# EAGLE schematic pc_healthypi_5.3 (EAGLE 9.6.2)

## Sheet 1 of 3
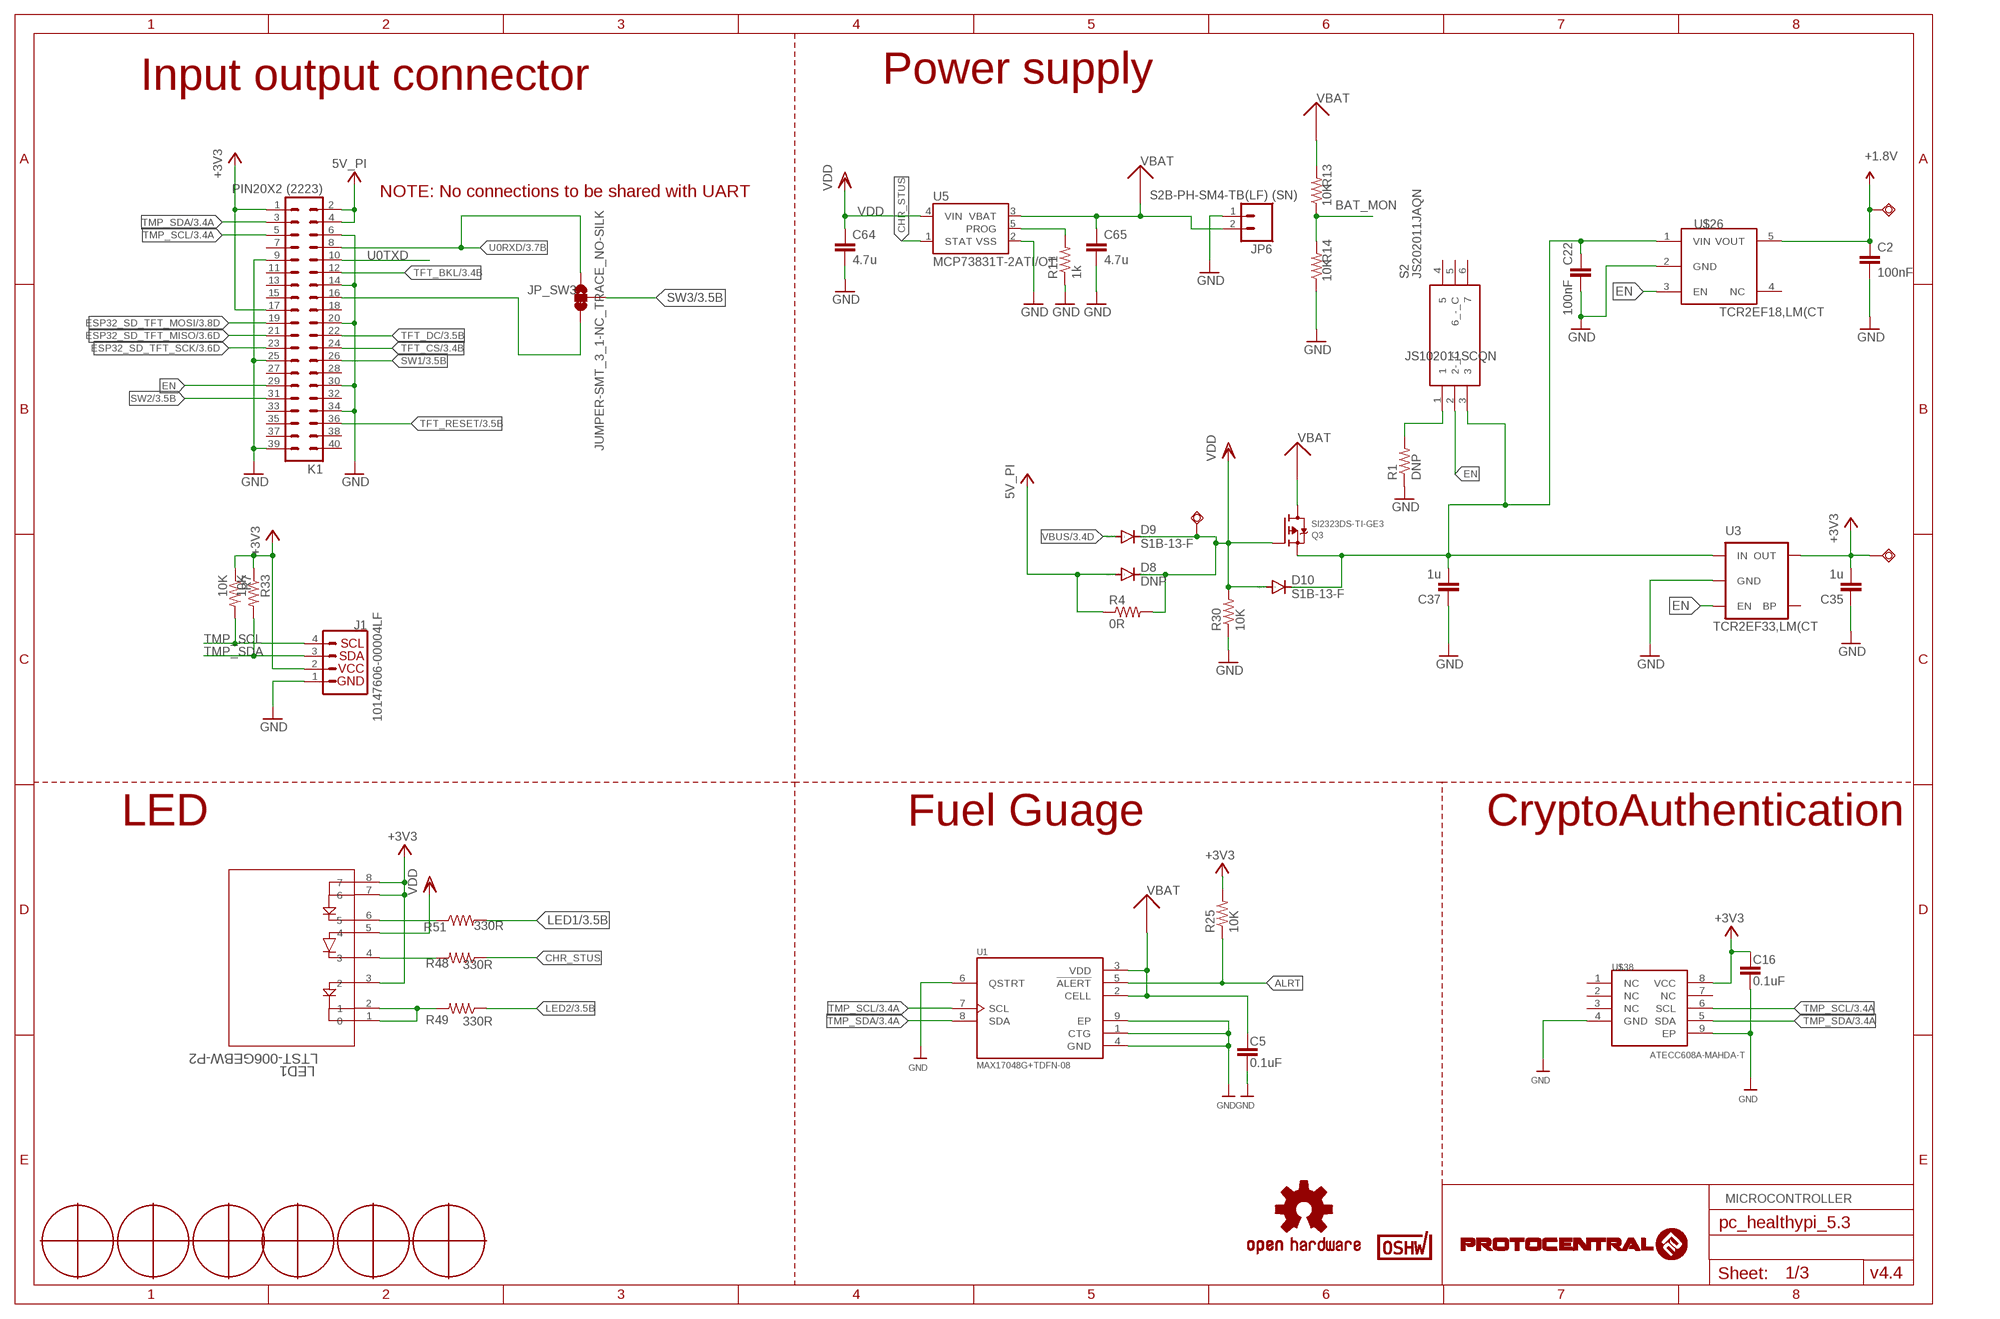
[diagram p0: schematic, sheet 1]

### Parts
C2  100nF  C-EUC0402  [C0402]
C5  0.1uF  0.1UF-0402T-6.3V-10%-X7R  [0402-TIGHT]
C16  0.1uF  0.1UF-0402T-6.3V-10%-X7R  [0402-TIGHT]
C22  100nF  C-EUC0402  [C0402]
C35  1u  C-EUC0402  [C0402]
C37  1u  C-EUC0402  [C0402]
C64  4.7u  C-EUC0805  [C0805]
C65  4.7u  C-EUC0805  [C0805]
D8  DNP  CGRM4001-G  [SOD-123_MINI-SMA]
D9  S1B-13-F  CGRM4001-G  [SOD-123_MINI-SMA]
D10  S1B-13-F  CGRM4001-G  [SOD-123_MINI-SMA]
J1  10147606-00004LF  QWIIC_CONNECTORJS-1MM  [JST04_1MM_RA]
JP6  S2B-PH-SM4-TB(LF) (SN)  M02-JST-2MM-SMT  [JST-2-SMD]
JP_SW3  JUMPER-SMT_3_1-NC_TRACE_NO-SILK  [SMT-JUMPER_3_1-NC_TRACE_NO-SILK]
K1  PIN20X2 (2223)  PIN20X2  [PIN_20X2]
LED1  LTST-006GEBW-P2  [LTST-008BGEW_LTO]
Q3  SI2323DS-TI-GE3  MOSFET-P  [SOT23-R]
R1  DNP  R-US_R0402  [R0402]
R4  0R  RESISTOR0805-RES  [0805]
R7  10K  R-US_R0402  [R0402]
R11  1k  R-US_R0402  [R0402]
R13  10K  R-US_R0402  [R0402]
R14  10K  R-US_R0402  [R0402]
R25  10K  RESISTOR0402-RES  [0402-RES]
R30  10K  R-US_R0402  [R0402]
R33  10K  R-US_R0402  [R0402]
R48  330R  RESISTOR0402-RES  [0402-RES]
R49  330R  RESISTOR0402-RES  [0402-RES]
R51  330R  RESISTOR0402-RES  [0402-RES]
S2  JS202011JAQN  [JS202011JAQN]
SWIO1  TPSQTP11R  [TP11R]
SWIO5  TPSQTP11R  [TP11R]
SWIO7  TPSQTP11R  [TP11R]
U1  MAX17048G+TDFN-08  [SON50P200X200X80-9N]
U3  TCR2EF33,LM(CT  V_REG_LDOSMD  [SOT23-5]
U5  MCP73831T-2ATI/OT  MCP73831  [SOT23-5]
U$1  FUDCIALPOINTS  [FIDUCIALPOINTS]
U$5  OSHW-LOGOM  [OSHW-LOGO-M]
U$13  CERT-SMALL  [CERT-SMALL-SILK]
U$21  FUDCIALPOINTS  [FIDUCIALPOINTS]
U$23  FUDCIALPOINTS  [FIDUCIALPOINTS]
U$25  FUDCIALPOINTS  [FIDUCIALPOINTS]
U$26  TCR2EF18,LM(CT  AP7354D-18W5-7  [SOT95P285X140-5N]
U$28  FUDCIALPOINTS  [FIDUCIALPOINTS]
U$29  FUDCIALPOINTS  [FIDUCIALPOINTS]
U$38  ATECC608A-MAHDA-T  ATECC608B-TFLXTLS  [PSON50P200X300X60-9N]

### Nets
+1.8V: C2.1 SWIO5.TP U$26.5(VOUT) ; also sheet 2
+3V3: C16.1 C35.2 J1.2 K1.1 K1.17 LED1.3 LED1.7 LED1.8 R7.1 R25.2 R33.1 SWIO1.TP U3.5(OUT) U$38.8(VCC) ; also sheet 2,3
+5V: D8.A K1.2 K1.4 R4.1 ; supply symbol labelled 5V_PI
ALRT: R25.1 U1.5(!ALERT)
BAT_MON: R13.1 R14.2 ; also sheet 3
CHR_STUS: R48.1 U5.1(STAT)
EN: K1.29 S2.2(2-_C) U3.3(EN) U$26.3(EN)
ESP32_SD_TFT_MISO: K1.21 ; also sheet 3
ESP32_SD_TFT_MOSI: K1.19 ; also sheet 3
ESP32_SD_TFT_SCK: K1.23 ; also sheet 3
GND: C2.2 C5.2 C16.2 C22.2 C35.1 C37.1 C64.2 C65.2 J1.1 JP6.1 K1.6 K1.9 K1.14 K1.20 K1.25 K1.30 K1.34 K1.39 R1.1 R11.1 R14.1 R30.1 U1.1(CTG) U1.4(GND) U1.6(QSTRT) U1.9(EP) U3.2(GND) U5.2(VSS) U$26.2(GND) U$38.4(GND) U$38.9(EP) ; also sheet 2,3
LED1: R51.2 ; also sheet 3
LED2: R49.1 ; also sheet 3
N$1: R1.2 S2.1
N$2: LED1.4 R48.2
N$3: JP_SW3.3 K1.16
N$8: C22.1 C37.2 D10.C Q3.2(S) S2.3 U3.1(IN) U$26.1(VIN)
N$18: R11.2 U5.5(PROG)
N$36: LED1.1 LED1.2 R49.2
N$46: LED1.6 R51.1
SW1: K1.26 ; also sheet 3
SW2: K1.31 ; also sheet 3
SW3: JP_SW3.2 ; also sheet 3
TFT_BKL: K1.12 ; also sheet 3
TFT_CS: K1.24 ; also sheet 3
TFT_DC: K1.22 ; also sheet 3
TFT_RESET: K1.36 ; also sheet 3
TMP_SCL: J1.4 K1.5 R7.2 U1.7(SCL) U$38.6(SCL) ; also sheet 3
TMP_SDA: J1.3 K1.3 R33.2 U1.8(SDA) U$38.5(SDA) ; also sheet 3
U0RXD: JP_SW3.1 K1.8 ; also sheet 3
U0TXD: K1.10 ; also sheet 3
VBAT: C5.1 C65.1 JP6.2 Q3.3(D) R13.2 U1.2(CELL) U1.3(VDD) U5.3(VBAT)
VBUS: D9.A ; also sheet 3
VDD: C64.1 D8.C D9.C D10.A LED1.5 Q3.1(G) R4.2 R30.2 SWIO7.TP U5.4(VIN)
Unconnected: K1.7 K1.11 K1.13 K1.15 K1.18 K1.27 K1.28 K1.32 K1.33 K1.35 K1.37 K1.38 K1.40 S2.4 S2.5(6_-_C) S2.6 U3.4(BP) U$26.4(NC) U$38.1(NC) U$38.2(NC) U$38.3(NC) U$38.7(NC)

### Notes on the sheet
- Input output connector | Power supply
- NOTE: No connections to be shared with UART
- JS102011SCQN
- LED | Fuel Guage | CryptoAuthentication
- MICROCONTROLLER
- v4.4

## Sheet 2 of 3
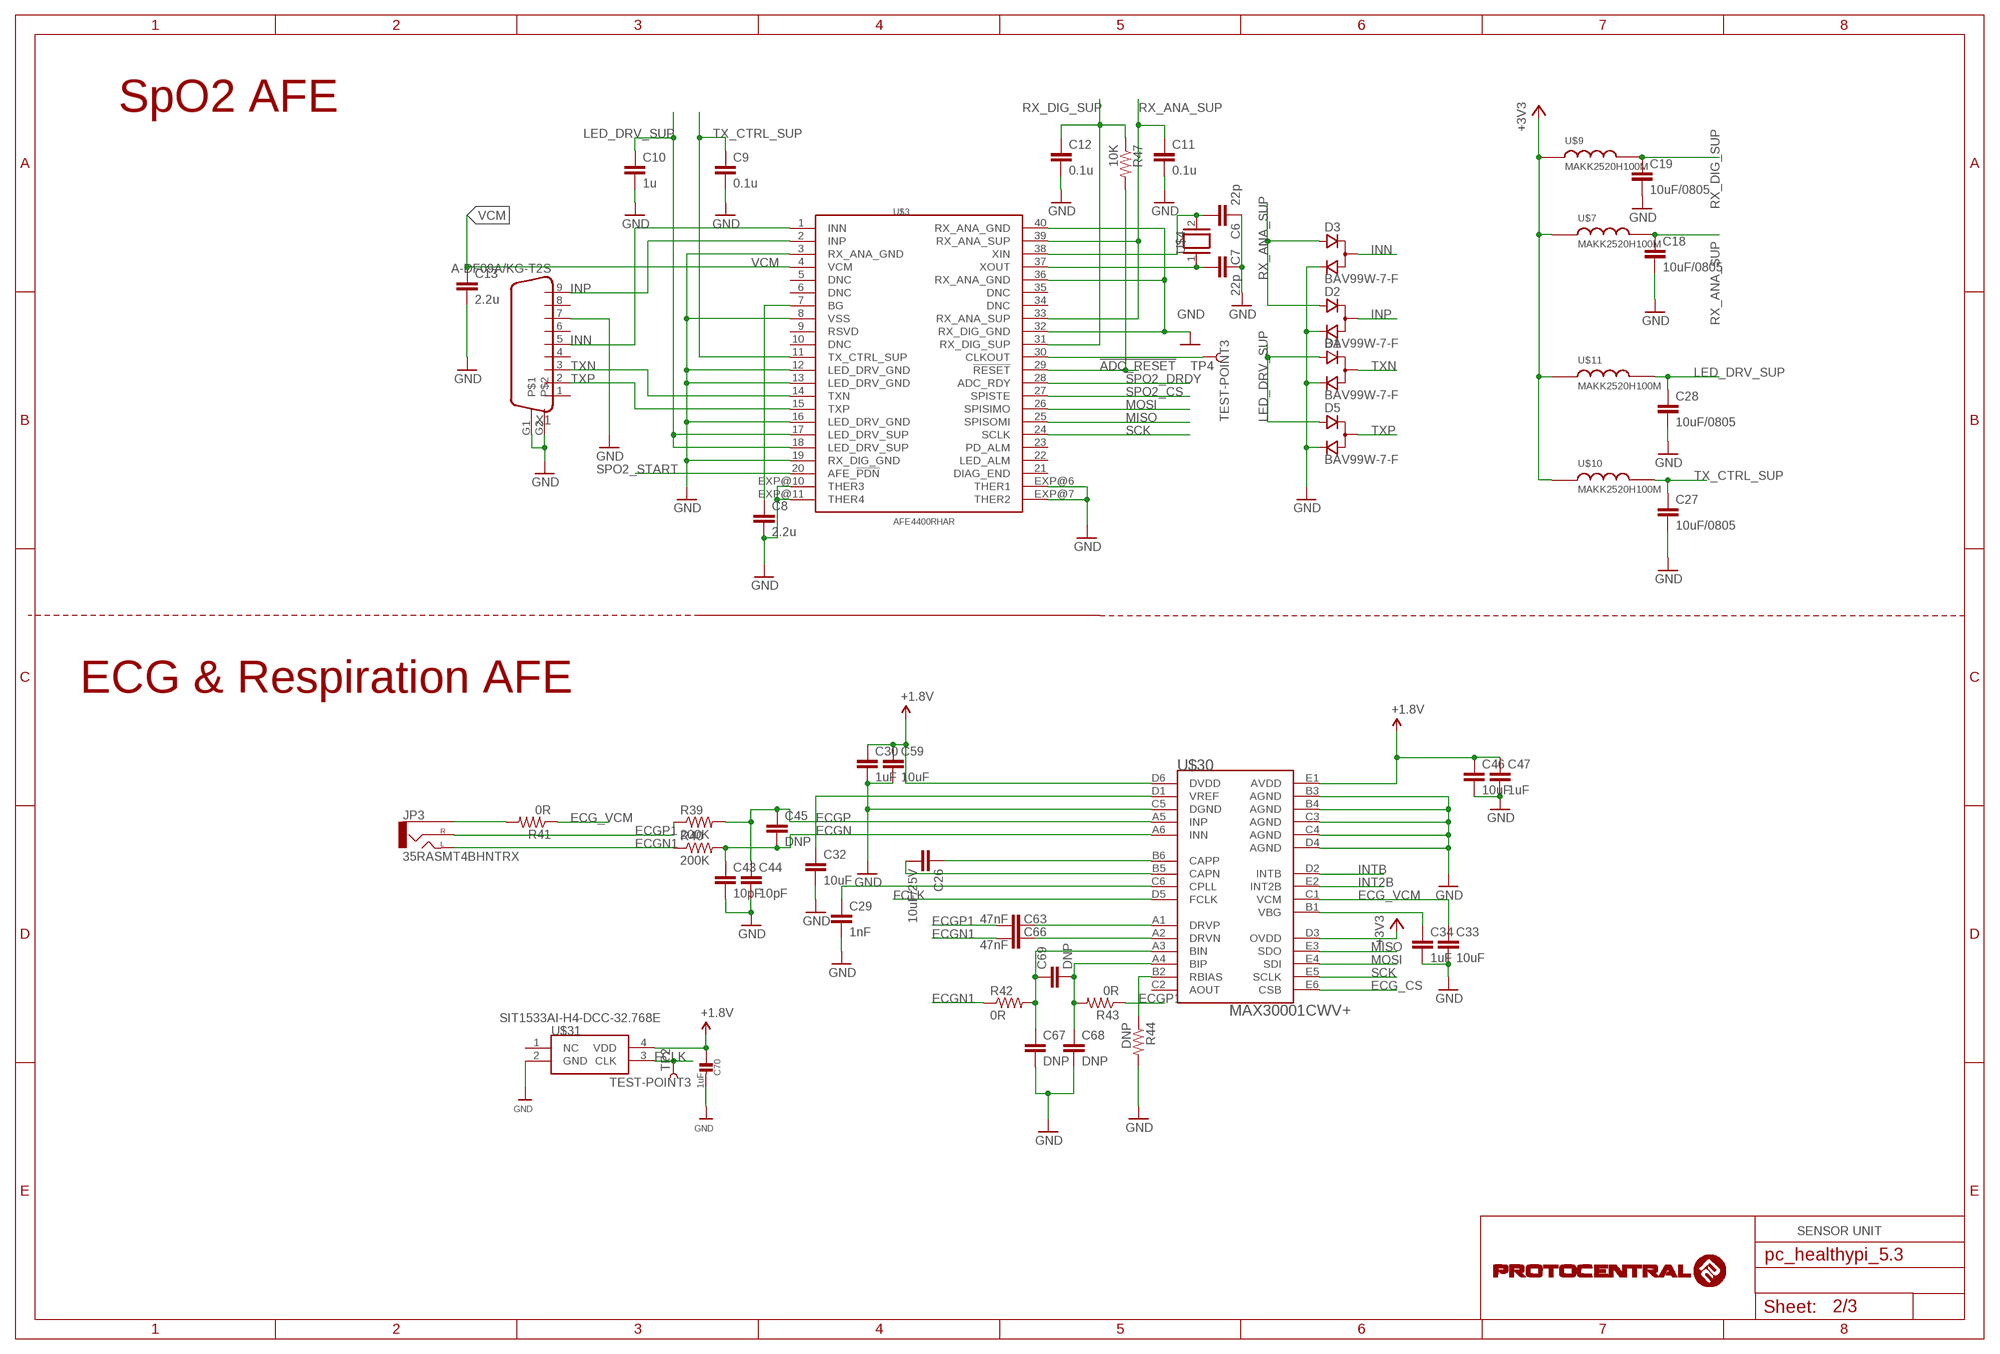
[diagram p1: schematic, sheet 2]

### Parts
C6  22p  C-EUC0402  [C0402]
C7  22p  C-EUC0402  [C0402]
C8  2.2u  C-EUC0402  [C0402]
C9  0.1u  C-EUC0402  [C0402]
C10  1u  C-EUC0805  [C0805]
C11  0.1u  C-EUC0402  [C0402]
C12  0.1u  C-EUC0402  [C0402]
C13  2.2u  C-EUC0402  [C0402]
C18  10uF/0805  C-EUC0805  [C0805]
C19  10uF/0805  C-EUC0805  [C0805]
C26  10uF/25V  C-EUC0805  [C0805]
C27  10uF/0805  C-EUC0805  [C0805]
C28  10uF/0805  C-EUC0805  [C0805]
C29  1nF  C-EUC0402  [C0402]
C30  1uF  C-EUC0402  [C0402]
C32  10uF  C-EUC0805  [C0805]
C33  10uF  C-EUC0805  [C0805]
C34  1uF  C-EUC0402  [C0402]
C43  10pF  C-EUC0402  [C0402]
C44  10pF  C-EUC0402  [C0402]
C45  DNP  C-EUC0402  [C0402]
C46  10uF  C-EUC0805  [C0805]
C47  1uF  C-EUC0402  [C0402]
C59  10uF  C-EUC0805  [C0805]
C63  47nF  C-EUC0402  [C0402]
C66  47nF  C-EUC0402  [C0402]
C67  DNP  C-EUC0402  [C0402]
C68  DNP  C-EUC0402  [C0402]
C69  DNP  C-EUC0402  [C0402]
C70  1uF  CAP_CERAMIC0402  [0402]
D1  BAV99W-7-F  D_ACACSOT323  [SOT323]
D2  BAV99W-7-F  D_ACACSOT323  [SOT323]
D3  BAV99W-7-F  D_ACACSOT323  [SOT323]
D5  BAV99W-7-F  D_ACACSOT323  [SOT323]
JP3  35RASMT4BHNTRX  AUDIO-JACKSMD2  [AUDIO-JACK-3.5MM-SMD]
R39  200K  RESISTOR0805-RES  [0805]
R40  200K  RESISTOR0805-RES  [0805]
R41  0R  RESISTOR0805-RES  [0805]
R42  0R  RESISTOR0402-RES  [0402-RES]
R43  0R  RESISTOR0402-RES  [0402-RES]
R44  DNP  RESISTOR0402-RES  [0402-RES]
R47  10K  R-US_R0402  [R0402]
TP2  TEST-POINT3  [PAD.03X.03]
TP4  TEST-POINT3  [PAD.03X.03]
U$3  AFE4400RHAR  AFE4400  [QFN-40]
U$4  HC-49/U-S16000000ABJB  [XTAL_HC49P488W43L1150T466H350]
U$7  MAKK2520H100M  LPS  [LPS]
U$9  MAKK2520H100M  LPS  [LPS]
U$10  MAKK2520H100M  LPS  [LPS]
U$11  MAKK2520H100M  LPS  [LPS]
U$30  MAX30001CWV+  [30WLP]
U$31  SIT1533AI-H4-DCC-32.768E  SIT1533  [SIT1533]
X1  A-DF09A/KG-T2S  DB9  [DB9]

### Nets
!ADC_RESET: R47.2 U$3.29(!RESET)
+1.8V: C30.1 C46.1 C47.1 C59.1 C70.1 U$30.D6(DVDD) U$30.E1(AVDD) U$31.4(VDD) ; also sheet 1
+3V3: U$7.1 U$9.1 U$10.1 U$11.1 U$30.D3(OVDD) ; also sheet 1,3
ECG_CS: U$30.E6(CSB) ; also sheet 3
ECG_VCM: C33.1 R41.1 U$30.C1(VCM)
ECGN: C43.1 C45.2 R40.2 U$30.A6(INN)
ECGN1: C66.1 JP3.TIP(LEFT) R40.1 R42.1
ECGP: C44.1 C45.1 R39.2 U$30.A5(INP)
ECGP1: C63.1 JP3.RING(RIGHT) R39.1 R43.1
FCLK: TP2.P$1 U$30.D5(FCLK) U$31.3(CLK)
GND: C6.1 C7.1 C8.2 C9.2 C10.2 C11.2 C12.2 C13.2 C18.2 C19.2 C27.2 C28.2 C29.2 C30.2 C32.2 C33.2 C34.2 C43.2 C44.2 C46.2 C47.2 C59.2 C67.2 C68.2 C70.2 D1.2(C) D2.2(C) D3.2(C) D5.2(C) R44.2 U$3.3(RX_ANA_GND) U$3.8(VSS) U$3.12(LED_DRV_GND) U$3.13(LED_DRV_GND) U$3.16(LED_DRV_GND) U$3.19(RX_DIG_GND) U$3.32(RX_DIG_GND) U$3.36(RX_ANA_GND) U$3.40(RX_ANA_GND) U$3.EXP@6(THER1) U$3.EXP@7(THER2) U$3.EXP@10(THER3) U$3.EXP@11(THER4) U$30.B3(AGND) U$30.B4(AGND) U$30.C3(AGND) U$30.C4(AGND) U$30.C5(DGND) U$30.D4(AGND) U$31.2(GND) X1.7 X1.G1 X1.G2 ; also sheet 1,3
INN: D3.1(CA) U$3.1(INN) X1.5
INP: D2.1(CA) U$3.2(INP) X1.9
INT2B: U$30.E2(INT2B) ; also sheet 3
INTB: U$30.D2(INTB) ; also sheet 3
LED_DRV_SUP: C10.1 C28.1 D1.3(A) D5.3(A) U$3.17(LED_DRV_SUP) U$3.18(LED_DRV_SUP) U$11.2
MISO: U$3.25(SPISOMI) U$30.E3(SDO) ; also sheet 3
MOSI: U$3.26(SPISIMO) U$30.E4(SDI) ; also sheet 3
N$9: C6.2 U$3.38(XIN) U$4.2
N$13: C7.2 U$3.37(XOUT) U$4.1
N$15: C8.1 U$3.7(BG)
N$16: TP4.P$1 U$3.30(CLKOUT)
N$53: C29.1 U$30.C6(CPLL)
N$55: C26.2 U$30.B5(CAPN)
N$56: C32.1 U$30.D1(VREF)
N$57: C34.1 U$30.B1(VBG)
N$59: JP3.SLEEVE R41.2
N$60: C26.1 U$30.B6(CAPP)
N$61: C63.2 U$30.A1(DRVP)
N$62: C66.2 U$30.A2(DRVN)
N$63: C67.1 C69.1 R42.2 U$30.A3(BIN)
N$64: C68.1 C69.2 R43.2 U$30.A4(BIP)
N$65: R44.1 U$30.B2(RBIAS)
RX_ANA_SUP: C11.1 C18.1 D2.3(A) D3.3(A) U$3.33(RX_ANA_SUP) U$3.39(RX_ANA_SUP) U$7.2
RX_DIG_SUP: C12.1 C19.1 R47.1 U$3.31(RX_DIG_SUP) U$9.2
SCK: U$3.24(SCLK) U$30.E5(SCLK) ; also sheet 3
SPO2_CS: U$3.27(SPISTE) ; also sheet 3
SPO2_DRDY: U$3.28(ADC_RDY) ; also sheet 3
SPO2_START: U$3.20(AFE_!PDN) ; also sheet 3
TX_CTRL_SUP: C9.1 C27.1 U$3.11(TX_CTRL_SUP) U$10.2
TXN: D1.1(CA) U$3.14(TXN) X1.3
TXP: D5.1(CA) U$3.15(TXP) X1.2
VCM: C13.1 U$3.4(VCM)
Unconnected: U$3.5(DNC) U$3.6(DNC) U$3.9(RSVD) U$3.10(DNC) U$3.21(DIAG_END) U$3.22(LED_ALM) U$3.23(PD_ALM) U$3.34(DNC) U$3.35(DNC) U$30.C2(AOUT) U$31.1(NC) X1.1 X1.4 X1.6 X1.8

### Notes on the sheet
- SpO2 AFE
- ECG & Respiration AFE
- SENSOR UNIT

## Sheet 3 of 3
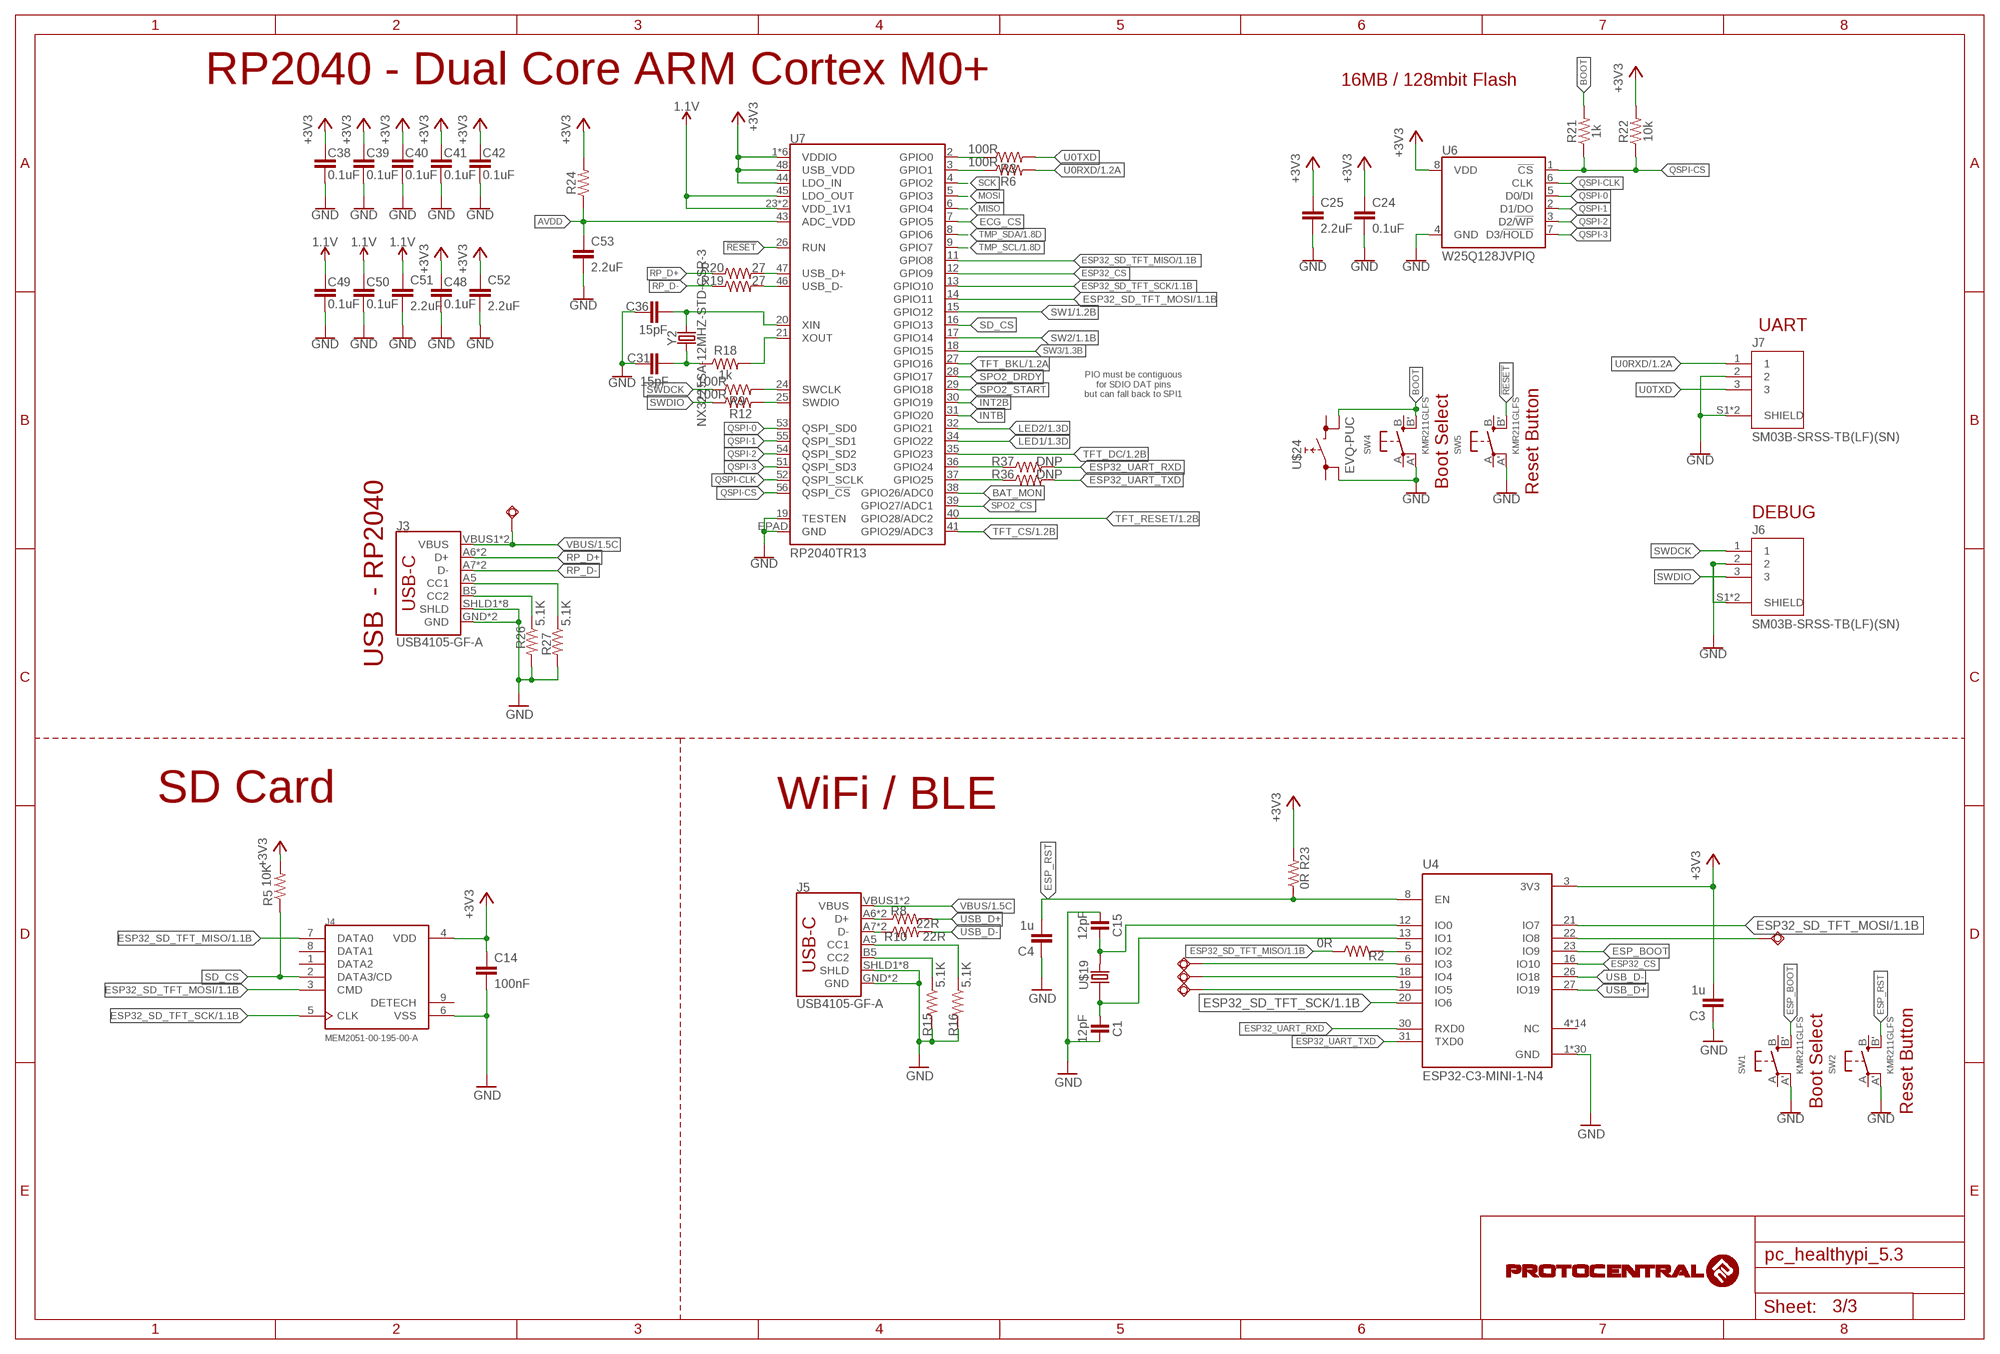
[diagram p2: schematic, sheet 3]

### Parts
C1  12pF  CAPACITORS-0402  [C0402]
C3  1u  C-EUC0402  [C0402]
C4  1u  C-EUC0402  [C0402]
C14  100nF  C-EUC0402  [C0402]
C15  12pF  CAPACITORS-0402  [C0402]
C24  0.1uF  0.1UF-0402T-6.3V-10%-X7R  [0402-TIGHT]
C25  2.2uF  2.2UF-0402_TIGHT-10V-10%-X5R  [0402-TIGHT]
C31  15pF  15PF-0402T-50V-5%  [0402-TIGHT]
C36  15pF  15PF-0402T-50V-5%  [0402-TIGHT]
C38  0.1uF  0.1UF-0402T-6.3V-10%-X7R  [0402-TIGHT]
C39  0.1uF  0.1UF-0402T-6.3V-10%-X7R  [0402-TIGHT]
C40  0.1uF  0.1UF-0402T-6.3V-10%-X7R  [0402-TIGHT]
C41  0.1uF  0.1UF-0402T-6.3V-10%-X7R  [0402-TIGHT]
C42  0.1uF  0.1UF-0402T-6.3V-10%-X7R  [0402-TIGHT]
C48  0.1uF  0.1UF-0402T-6.3V-10%-X7R  [0402-TIGHT]
C49  0.1uF  0.1UF-0402T-6.3V-10%-X7R  [0402-TIGHT]
C50  0.1uF  0.1UF-0402T-6.3V-10%-X7R  [0402-TIGHT]
C51  2.2uF  2.2UF-0402_TIGHT-10V-10%-X5R  [0402-TIGHT]
C52  2.2uF  2.2UF-0402_TIGHT-10V-10%-X5R  [0402-TIGHT]
C53  2.2uF  2.2UF-0402_TIGHT-10V-10%-X5R  [0402-TIGHT]
J3  USB4105-GF-A  USB_C16PIN  [USB-C-16P]
J4  MEM2051-00-195-00-A  [GCT_MEM2051-00-195-00-A]
J5  USB4105-GF-A  USB_C16PIN  [USB-C-16P]
J6  SM03B-SRSS-TB(LF)(SN)  [JST_SM03B-SRSS-TB(LF)(SN)]
J7  SM03B-SRSS-TB(LF)(SN)  [JST_SM03B-SRSS-TB(LF)(SN)]
R2  0R  R-US_R0402  [R0402]
R3  100R  R-US_R0402  [R0402]
R5  10K  R-US_R0402  [R0402]
R6  100R  R-US_R0402  [R0402]
R8  22R  R-US_R0402  [R0402]
R9  100R  R-US_R0402  [R0402]
R10  22R  R-US_R0402  [R0402]
R12  100R  R-US_R0402  [R0402]
R15  5.1K  R-US_R0402  [R0402]
R16  5.1K  R-US_R0402  [R0402]
R18  1k  1KOHM-0402T-1/16W-1%  [0402-TIGHT]
R19  27  27OHM  [0402-TIGHT]
R20  27  27OHM  [0402-TIGHT]
R21  1k  1KOHM-0402T-1/16W-1%  [0402-TIGHT]
R22  10k  10KOHM-0402T-1/16W-1%  [0402-TIGHT]
R23  0R  R-US_R0402  [R0402]
R24  200OHM-0402T-1/16W-1%  [0402-TIGHT]
R26  5.1K  R-US_R0402  [R0402]
R27  5.1K  R-US_R0402  [R0402]
R36  DNP  27OHM  [0402-TIGHT]
R37  DNP  27OHM  [0402-TIGHT]
SW1  KMR211GLFS  SWITCH_TACT_SMT4.6X2.8  [BTN_KMR2_4.6X2.8]
SW2  KMR211GLFS  SWITCH_TACT_SMT4.6X2.8  [BTN_KMR2_4.6X2.8]
SW4  KMR211GLFS  SWITCH_TACT_SMT4.6X2.8  [BTN_KMR2_4.6X2.8]
SW5  KMR211GLFS  SWITCH_TACT_SMT4.6X2.8  [BTN_KMR2_4.6X2.8]
SWIO2  TPSQTP11R  [TP11R]
SWIO3  TPSQTP11R  [TP11R]
SWIO4  TPSQTP11R  [TP11R]
SWIO6  TPSQTP11R  [TP11R]
TP5  TPSQTP11R  [TP11R]
U4  ESP32-C3-MINI-1-N4  [XCVR_ESP32-C3-MINI-1-N4]
U6  W25Q128JVPIQ  W25QXX128MBIT-6X5-SKINNY_CENTER  [WSON-8-6X5-SKINNY_CENTERPAD]
U7  RP2040TR13  RP2040  [QFN-56]
U$19  520-327-12.5-34B(32.768KHZ)  ECS-X-34B  [ECX-31B]
U$24  EVQ-PUC  [EVQ-PUC]
Y2  NX3225SA-12MHZ-STD-CSR-3  CRYSTAL-12MHZ  [CRYSTAL-SMD-2X2.5MM]

### Nets
1.1V: C49.1 C50.1 C51.1 U7.23(VDD_1V1) U7.45(LDO_OUT) U7.50(VDD_1V1)
!RESET!: SW5.B'(S1) U7.26(RUN)
+3V3: C3.2 C14.1 C24.1 C25.1 C38.1 C39.1 C40.1 C41.1 C42.1 C48.1 C52.1 J4.4(VDD) R5.2 R22.2 R23.2 R24.2 U4.3(3V3) U6.8(VDD) U7.1(VDDIO) U7.10(VDDIO) U7.22(VDDIO) U7.33(VDDIO) U7.42(VDDIO) U7.44(LDO_IN) U7.48(USB_VDD) U7.49(VDDIO) ; also sheet 1,2
AVDD: C53.1 R24.1 U7.43(ADC_VDD)
BAT_MON: U7.38(GPIO26/ADC0) ; also sheet 1
BOOT: R21.2 SW4.B'(S1) U$24.2
ECG_CS: U7.7(GPIO5) ; also sheet 2
ESP32_CS: U4.16(IO10) U7.12(GPIO9)
ESP32_MISO: R2.2 U4.5(IO2)
ESP32_SD_TFT_MISO: J4.7(DATA0) R2.1 U7.11(GPIO8) ; also sheet 1
ESP32_SD_TFT_MOSI: J4.3(CMD) U4.21(IO7) U7.14(GPIO11) ; also sheet 1
ESP32_SD_TFT_SCK: J4.5(CLK) U4.20(IO6) U7.13(GPIO10) ; also sheet 1
ESP32_UART_RXD: R37.2 U4.30(RXD0)
ESP32_UART_TXD: R36.2 U4.31(TXD0)
ESP_BOOT: SW1.B'(S1) U4.23(IO9)
ESP_RST: C4.2 R23.1 SW2.B'(S1) U4.8(EN)
GND: C1.2 C3.1 C4.1 C14.2 C15.1 C24.2 C25.2 C31.1 C36.1 C38.2 C39.2 C40.2 C41.2 C42.2 C48.2 C49.2 C50.2 C51.2 C52.2 C53.2 J3.GND J3.GND2(GND) J3.SHLD1(SHLD) J3.SHLD2(SHLD) J3.SHLD3(SHLD) J3.SHLD4(SHLD) J3.SHLD5(SHLD) J3.SHLD6(SHLD) J3.SHLD7(SHLD) J3.SHLD8(SHLD) J4.6(VSS) J5.GND J5.GND2(GND) J5.SHLD1(SHLD) J5.SHLD2(SHLD) J5.SHLD3(SHLD) J5.SHLD4(SHLD) J5.SHLD5(SHLD) J5.SHLD6(SHLD) J5.SHLD7(SHLD) J5.SHLD8(SHLD) J6.2 J6.S1(SHIELD) J6.S2(SHIELD) J7.2 J7.S1(SHIELD) J7.S2(SHIELD) R15.2 R16.2 R26.2 R27.2 SW1.A'(P1) SW2.A'(P1) SW4.A'(P1) SW5.A'(P1) U4.1(GND) U4.2(GND) U4.11(GND) U4.14(GND) U4.36(GND) U4.37(GND) U4.38(GND) U4.39(GND) U4.40(GND) U4.41(GND) U4.42(GND) U4.43(GND) U4.44(GND) U4.45(GND) U4.46(GND) U4.47(GND) U4.48(GND) U4.49_1(GND) U4.49_2(GND) U4.49_3(GND) U4.49_4(GND) U4.49_5(GND) U4.49_6(GND) U4.49_7(GND) U4.49_8(GND) U4.49_9(GND) U4.50(GND) U4.51(GND) U4.52(GND) U4.53(GND) U6.4(GND) U7.19(TESTEN) U7.EPAD(GND) U$24.3 ; also sheet 1,2
INT2B: U7.30(GPIO19) ; also sheet 2
INTB: U7.31(GPIO20) ; also sheet 2
LED1: U7.34(GPIO22) ; also sheet 1
LED2: U7.32(GPIO21) ; also sheet 1
MISO: U7.6(GPIO4) ; also sheet 2
MOSI: U7.5(GPIO3) ; also sheet 2
N$4: R3.1 U7.2(GPIO0)
N$5: R6.1 U7.3(GPIO1)
N$6: R9.2 U7.24(SWCLK)
N$7: J5.B5(CC2) R15.1
N$10: J5.A5(CC1) R16.1
N$11: SWIO3.TP U4.6(IO3)
N$12: J5.A6(D+) J5.B6(D+) R8.1
N$14: R18.2 U7.21(XOUT)
N$17: J5.A7(D-) J5.B7(D-) R10.1
N$19: C36.2 U7.20(XIN) Y2.P3
N$20: C31.2 R18.1 Y2.P1
N$21: J3.B5(CC2) R26.1
N$23: SWIO4.TP U4.18(IO4)
N$25: C15.2 U4.12(IO0) U$19.P$2
N$26: J3.A5(CC1) R27.1
N$27: C1.1 U4.13(IO1) U$19.P$1
N$28: R37.1 U7.36(GPIO24)
N$29: R36.1 U7.37(GPIO25)
N$30: SWIO6.TP U4.19(IO5)
N$31: SWIO2.TP U4.22(IO8)
N$32: R12.2 U7.25(SWDIO)
QSPI-0: U6.5(D0/DI) U7.53(QSPI_SD0)
QSPI-1: U6.2(D1/DO) U7.55(QSPI_SD1)
QSPI-2: U6.3(D2/!WP!) U7.54(QSPI_SD2)
QSPI-3: U6.7(D3/!HOLD!) U7.51(QSPI_SD3)
QSPI-CLK [Clock]: U6.6(CLK) U7.52(QSPI_SCLK)
QSPI-CS: R21.1 R22.1 U6.1(!CS!) U7.56(QSPI_!CS!)
RP_D+: J3.A6(D+) J3.B6(D+) R20.1
RP_D-: J3.A7(D-) J3.B7(D-) R19.1
SCK: U7.4(GPIO2) ; also sheet 2
SD_CS: J4.2(DATA3/CD) R5.1 U7.16(GPIO13)
SPO2_CS: U7.39(GPIO27/ADC1) ; also sheet 2
SPO2_DRDY: U7.28(GPIO17) ; also sheet 2
SPO2_START: U7.29(GPIO18) ; also sheet 2
SW1: U7.15(GPIO12) ; also sheet 1
SW2: U7.17(GPIO14) ; also sheet 1
SW3: U7.18(GPIO15) ; also sheet 1
SWDCK: J6.1 R9.1
SWDIO: J6.3 R12.1
TFT_BKL: U7.27(GPIO16) ; also sheet 1
TFT_CS: U7.41(GPIO29/ADC3) ; also sheet 1
TFT_DC: U7.35(GPIO23) ; also sheet 1
TFT_RESET: U7.40(GPIO28/ADC2) ; also sheet 1
TMP_SCL: U7.9(GPIO7) ; also sheet 1
TMP_SDA: U7.8(GPIO6) ; also sheet 1
U0RXD: J7.1 R6.2 ; also sheet 1
U0TXD: J7.3 R3.2 ; also sheet 1
USB_D+: R8.2 U4.27(IO19)
USB_D-: R10.2 U4.26(IO18)
USB_F_N: R19.2 U7.46(USB_D-)
USB_F_P: R20.2 U7.47(USB_D+)
VBUS: J3.VBUS1(VBUS) J3.VBUS2(VBUS) J5.VBUS1(VBUS) J5.VBUS2(VBUS) TP5.TP ; also sheet 1
Unconnected: J4.1(DATA2) J4.8(DATA1) J4.9(DETECH) SW1.A(P) SW1.B(S) SW2.A(P) SW2.B(S) SW4.A(P) SW4.B(S) SW5.A(P) SW5.B(S) U4.4(NC) U4.7(NC) U4.9(NC) U4.10(NC) U4.15(NC) U4.17(NC) U4.24(NC) U4.25(NC) U4.28(NC) U4.29(NC) U4.32(NC) U4.33(NC) U4.34(NC) U4.35(NC) U$24.1 U$24.4

### Notes on the sheet
- RP2040 - Dual Core ARM Cortex M0+
- 16MB / 128mbit Flash
- UART
- PIO must be contiguous
  for SDIO DAT pins
  but can fall back to SPI1
- Boot Select | Reset Button
- DEBUG
- USB  - RP2040
- SD Card | WiFi / BLE
- Boot Select | Reset Button

## Library data of the parts
C1 C15 = Arduino:CAPACITORS: Capacitors ...4.7uF @ 6.3V -> 0402 ...10uF @ 16V -> 0603 ...22uF @ 25V -> 0805
C2-C4 C6-C13 C18 C19 C22 C26-C30 C32-C35 C37 C43-C47 C59 C63-C69 = rcl:C-EU: CAPACITOR, European symbol; SPICEPREFIX: C
C5 C16 C24 C38-C42 C48-C50 = SparkFun-Capacitors:0.1UF: 0.1µF ceramic capacitors A capacitor is a passive two-terminal electrical component used to store electrical energy temporarily in an electric field.; PROD_ID: CAP-14993
C14 = rcl:C-EU: CAPACITOR, European symbol
C25 C51-C53 = SparkFun-Capacitors:2.2UF: 2.2µF ceramic capacitors A capacitor is a passive two-terminal electrical component used to store electrical energy temporarily in an electric field.; PROD_ID: CAP-14232
C31 C36 = SparkFun-Capacitors:15PF: 15pF ceramic capacitors A capacitor is a passive two-terminal electrical component used to store electrical energy temporarily in an electric field.; PROD_ID: CAP-13063
C70 = microbuilder:CAP_CERAMIC: Ceramic Capacitors 0402 - 0402 Surface Mount Capacitors 16pF 50V 5% [Digikey: 445-4899-2-ND] 18pF 50V 5% [Digikey: 490-1281-2-ND] 22pF 50V 5% [Digikey: 490-1283-2-ND] 68pF 50V 5% [Digikey: 490-1289-2-ND] 0.1uF 10V 10% [Digikey: 490-1318-2-ND] 1.0uF 6.3V 10% [Digikey: 490-1320-2-ND] 0603 - 0603 Surface Mount Capacitors 16 pF 50V 5% [Digikey: 445-5051-2-ND] 22 pF 50V [Digikey: PCC220ACVTR-ND] 33 pF 50V 5% [Digikey: 490-1415-1-ND] 56pF 50V 5% [Digikey: 490-1421-1-ND] 220pF 50V 5% [Digikey: 445-1285-1-ND] 680 pF 50V 2200 pF 50V 5% C0G [Digikey: 445-1297-1-ND] 5600 pF 100V 5% X7R [Digikey: 478-3711-1-ND] 0.1 µF 25V 10% [Digikey: PCC2277TR-ND] 0.22 µF 16V 10% X7R [Digikey: 445-1318-1-ND] 1.0 µF 25V 10% [Digikey: 445-5146-2-ND] 0603 - RF Specific 3pF 250V +/-0.1pF RF [Digikey: 712-1347-1-ND] 18 pF 250V 5% [Digikey: 478-3505-1-ND or 712-1322-1-ND] 56 pF 250V 5% C0G RF [Digikey: 490-4867-1-ND] 68 pF 250V RF [Digikey: 490-4868-1-ND] 0805 - 0805 Surface Mount Capacitors 220 pF 250V 2% RF Ceramic Capacitor [Digikey: 712-1398-1-ND] 1000 pF 50V 2% NP0 Ceramic Capacitor [Digikey: 478-3760-1-ND] 0.1 µF 25V 10% Ceramic Capacitor [Digikey: PCC1828TR-ND] 1.0 µF 16V 10% Ceramic Capacitor[Digikey: 490-1691-2-ND] 10.0 µF 10V 10% Ceramic Capacitor[Digikey: 709-1228-1-ND] 10.0 uF 16V 10% Ceramic Capacitor [Digikey: 478-5165-2-ND] 47 uF 6.3V 20% Ceramic Capacitor [Digikey: 587-1779-1-ND or 399-5506-1-ND] 1206 - 1206 Surface Mount Capacitors 47uF 10V 20% Ceramic Capacitor [Digikey: 490-5528-1-ND or 399-5508-1-ND or 445-6010-1-ND]
D1-D3 D5 = zetex:D_ACAC: Dual DIODE; OC_FARNELL: unknown; OC_NEWARK: unknown
D8-D10 = diode:CGRM400*-G: Molded plasitc,JEDEC SOD-123/Mini SMA Source: Comchip CGRM4001-G.pdf
J1 = SparkFun-Connectors:QWIIC_CONNECTOR: SparkFun I2C Standard Qwiic Connector An SMD 1mm pitch JST connector makes it easy and quick (get it? Qwiic?) to connect I2C devices to each other. The Qwiic system <http://www.sparkfun.com/qwiic> enables fast and solderless connection between popular platforms and various sensors and actuators. We carry 200mm <https://www.sparkfun.com/products/14204>, 100mm <https://www.sparkfun.com/products/14205>, 50mm <https://www.sparkfun.com/products/14206>, and breadboard friendly <https://www.sparkfun.com/products/14207> Qwiic cables. We also offer 10 pcs strips <https://www.sparkfun.com/products/14323> the SMD connectors.; PROD_ID: CONN-13694; VALUE: QWIIC_RIGHT_ANGLE
J3 = USB-C:USB_C: USB Type C 16Pin Connector
J4 = circuitects:MEM2051-00-195-00-A: Connector, Memory Card, Micro Sd, 8 Position, 1.1mm, Full Reel Check availability; AVAILABILITY: In Stock; DESCRIPTION: 9 (8 + 1) Position Card Connector microSD Surface Mount, Right Angle Gold, 1.95mm profile, Normally open switch, Push push, Top mount; MF: Global Connector Technology; MP: MEM2051-00-195-00-A; PACKAGE: None; PRICE: None; PURCHASE-URL: https://pricing.snapeda.com/search/part/MEM2051-00-195-00-A/?ref=eda
J5 = circuitects:USB_C: USB Type C 16Pin Connector
J6 J7 = circuitects:SM03B-SRSS-TB(LF)(SN): SH Series 3 Position 1 mm Pitch Surface Mount Side Entry Shrouded Header Check availability; AVAILABILITY: In Stock; DESCRIPTION: Connector Header Surface Mount, Right Angle 3 position 0.039 (1.00mm); MF: JST Sales America Inc.; MP: SM03B-SRSS-TB(LF)(SN); PACKAGE: None; PRICE: None; PURCHASE-URL: https://pricing.snapeda.com/search/part/SM03B-SRSS-TB(LF)(SN)/?ref=eda
JP3 = circuitects:AUDIO-JACK: 3.5mm Audio Jack Simple 3.5mm common PCB mount audio jack. SKU: PRT-08032; PROD_ID: CONN-10353
JP6 = SparkFun:M02: Header 2 Standard 2-pin 0.1" header. Use with straight break away headers (SKU : PRT-00116), right angle break away headers (PRT-00553), swiss pins (PRT-00743), machine pins (PRT-00117), and female headers (PRT-00115). Molex polarized connector foot print use with SKU : PRT-08233 with associated crimp pins and housings.
JP_SW3 = SparkFun-Jumpers:JUMPER-SMT_3_1-NC_TRACE: Normally closed trace jumper (1 of 2 connections) This jumper has a trace between two pads so it's normally closed (NC). The other connection is normally open (NO). Use a razor knife to open the connection. For best results follow the IPC guidelines for cutting traces: Cutout at least 0.063 mm (0.005 in). Remove all loose material to clean up the cut area. Seal the cut with an approved epoxy. Reapply solder to reclose the connection, or to close the NO connection.
K1 = FLYFISH:PIN20X2
LED1 = circuitects:LTST-006GEBW-P2; COPYRIGHT: Copyright (C) 2023 Ultra Librarian. All rights reserved.; DIGI-KEY_PART_NUMBER_1: 160-LTST-006GEBW-P2TR-ND; DIGI-KEY_PART_NUMBER_2: 160-LTST-006GEBW-P2CT-ND; DIGI-KEY_PART_NUMBER_3: 160-LTST-006GEBW-P2DKR-ND; MANUFACTURER_PART_NUMBER: LTST-006GEBW-P2; MFR_NAME: LITE-ON
Q3 = microbuilder:MOSFET-P: P-Channel Mosfet SOT-23 IRLML5103 30V 760mA 1V Vgs - Digikey: IRLML5103PBFCT-ND NTR0202PL 20V 400mA 2.3V Vgs - Digikey: NTR0202PLT1GOSTR-ND NTR4101PT1G 20V 1.8A 1.2V Vgs - Digikey: NTR4101PT1GOSCT-ND DMP2004K 20V 600mA 1V Vgs - Digikey: DMP2004KDICT-ND
R1-R3 R6-R16 R23 R26 R27 R30 R33 R47 = rcl:R-US_: RESISTOR, American symbol; SPICEPREFIX: R
R4 R25 R39-R44 R48 R49 R51 = SparkFun:RESISTOR: Resistor Basic schematic elements and footprints for 0603, 1206, and PTH resistors.
R5 = rcl:R-US_: RESISTOR, American symbol
R18 R21 = SparkFun-Resistors:1KOHM: 1kΩ resistor A resistor is a passive two-terminal electrical component that implements electrical resistance as a circuit element. Resistors act to reduce current flow, and, at the same time, act to lower voltage levels within circuits. - Wikipedia; PROD_ID: RES-14342
R19 R20 R36 R37 = SparkFun-Resistors:27OHM: 27Ω resistor A resistor is a passive two-terminal electrical component that implements electrical resistance as a circuit element. Resistors act to reduce current flow, and, at the same time, act to lower voltage levels within circuits. - Wikipedia; PROD_ID: RES-15238
R22 = SparkFun-Resistors:10KOHM: 10kΩ resistor A resistor is a passive two-terminal electrical component that implements electrical resistance as a circuit element. Resistors act to reduce current flow, and, at the same time, act to lower voltage levels within circuits. - Wikipedia; PROD_ID: RES-14241
R24 = SparkFun-Resistors:200OHM: 200Ω resistor A resistor is a passive two-terminal electrical component that implements electrical resistance as a circuit element. Resistors act to reduce current flow, and, at the same time, act to lower voltage levels within circuits. - Wikipedia; PROD_ID: RES-15550
S2 = circuitects:JS202011JAQN: JS Series Sub-Miniature Slide Switch Source: Datasheet Check availability; AVAILABILITY: In Stock; DESCRIPTION: Slide Switch DPDT Surface Mount, Right Angle; MF: C&K; MP: JS202011JAQN; PACKAGE: None; PRICE: None; PURCHASE-URL: https://pricing.snapeda.com/search/part/JS202011JAQN/?ref=eda
SW1 SW2 SW4 SW5 = microbuilder:SWITCH_TACT_SMT: SMT Tact Switches 6x6mm - Digikey: P12940SCT-ND KMR2 (4.6x2.8mm) - Digikey: 401-1426-1-ND EVQ-PQHB55 - Light Touch, 160GF (4.5x4.5mm) - Digikey: P8090SCT-ND
SWIO1-SWIO7 TP5 = testpad:TPSQ: Test pad
TP2 TP4 = SparkFun:TEST-POINT
U1 = circuitects:MAX17048G+: Micropower 1-Cell/2-Cell Li+ ModelGauge ICs Check availability; AVAILABILITY: In Stock; DESCRIPTION: 3µA 1-Cell/2-Cell Fuel Gauge with ModelGauge; MF: Analog Devices; MP: MAX17048G+; PACKAGE: TDFN-8 Maxim; PRICE: None; PURCHASE-URL: https://pricing.snapeda.com/search/part/MAX17048G+/?ref=eda
U3 = SparkFun-PowerIC:V_REG_LDO: Voltage Regulator LDO Standard 150mA LDO voltage regulator in SOT-23 layout. Micrel part MIC5205. BP (by-pass) pin is used to lower output noise with 470pF cap.; PROD_ID: VREG-12457
U4 = circuitects:ESP32-C3-MINI-1-N4: Check availability; AVAILABILITY: In Stock; DESCRIPTION: Bluetooth, WiFi 802.11b/g/n, Bluetooth v5.0 Transceiver Module 2.412GHz ~ 2.484GHz PCB Trace Surface Mount; MF: Espressif Systems; MP: ESP32-C3-MINI-1-N4; PACKAGE: SMD-53 Espressif Systems; PRICE: None; PURCHASE-URL: https://pricing.snapeda.com/search/part/ESP32-C3-MINI-1-N4/?ref=eda
U5 = SparkFun:MCP73831: Microchip's MCP73831 Miniature single cell, fully integrated Li-Ion, Li-polymer charge management controller http://ww1.microchip.com/downloads/en/DeviceDoc/21984a.pdf
U6 = SparkFun-IC-Memory:W25QXX; PROD_ID: IC-15107
U7 = circuitects:RP2040: Raspberry Pi RP2040 MCU 56-pin 32-bit Microcontroller with 264kB of SRAM and external flash support up to 16MB Getting Started with the RP2040 Dual-core ARM Cortex M0+ processor, flexible clock running up to 133 MHz 264kB of SRAM, and QSPI control of common flash memory USB 1.1 Host and Device support Low-power sleep and dormant modes Drag & drop programming using mass storage over USB 26 multi-function GPIO pins 2×SPI, 2×I2C, 2×UART, 3×12-bit ADC, 16×controllable PWM channels Accurate clock and timer on-chip Temperature sensor Accelerated floating point libraries on-chip 8×Programmable IO (PIO) state machines for custom peripheral support; PROD_ID: IC-15502
U$1 U$21 U$23 U$25 U$28 U$29 = circuitects:FUDCIALPOINTS
U$3 = circuitects:AFE4400
U$4 = circuitects:HC-49/U-S16000000ABJB: HC49US Series 16 MHz ±30 ppm 18 pF -20 to +70 °C Through Hole AT-CUT Crystal Check availability; AVAILABILITY: In Stock; DESCRIPTION: 16 MHz ±30ppm Crystal 18pF 50 Ohms HC-49/US; MF: Citizen Finedevice Co Ltd; MP: HC-49/U-S16000000ABJB; PACKAGE: HC-49/US Citizen Finetech Miyota; PRICE: None; PURCHASE-URL: https://pricing.snapeda.com/search/part/HC-49/U-S16000000ABJB/?ref=eda
U$5 = SparkFun:OSHW-LOGO: Open Source Hardware Logo This logo indicates the piece of hardware it is found on incorporates a OSHW license and/or adheres to the definition of open source hardware found here: http://freedomdefined.org/OSHW
U$7 U$9-U$11 = circuitects:LPS
U$13 = OSHWA:CERT
U$19 = circuitects:ECS-X-34B
U$24 = circuitects:EVQ-PUC
U$26 = circuitects:AP7354D-18W5-7
U$30 = circuitects:MAX30001CWV+
U$31 = circuitects:SIT1533
U$38 = circuitects:ATECC608B-TFLXTLS
X1 = circuitects:DB9: DB9 Connector Standard DB9 (D-Sub 9) serial connector. Can be used for CAN bus as well as RS485 and RS232. Footprint production proven. Spark Fun Electronics SKU : PRT-00429
Y2 = SparkFun-Clocks:CRYSTAL-12MHZ: 12.0MHz Crystal Frequency: 12.0MHz Frequency Tolerance: ±20ppm Load Capacitance: 18pF SparkFun Products: SparkFun Logomatic <https://www.sparkfun.com/products/12772> Pocket AVR Programmer <https://www.sparkfun.com/products/9825>; PROD_ID: XTAL-15540

## Net classes
1 power: width 0.178 mm
2 Clock: width 0.089 mm, clearance 0.178 mm
4 USBpair: width 0.102 mm, drill 0.1 mm, clearance 0.15 mm to class 3